# EAGLE design sram (EAGLE 7.3.0)
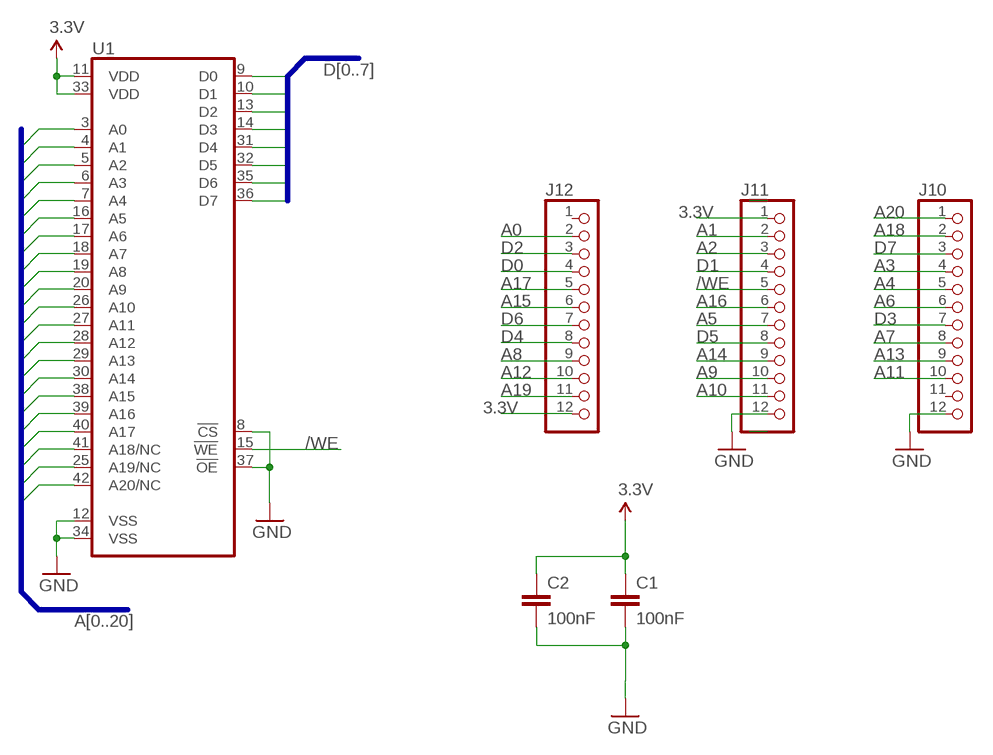
[diagram p0: schematic, sheet 1]

## Parts
C1  100nF  C-EUC0805K  [C0805K]
C2  100nF  C-EUC0805K  [C0805K]
J10  PINHD-1X12  [1X12]
J11  PINHD-1X12  [1X12]
J12  PINHD-1X12  [1X12]
U1  ISSI_SRAM_8BIT  [TSOP44-II]

## Nets
3.3V [power]: C1.1 C2.1 J11.1 J12.12 U1.11(VDD) U1.33(VDD)
/WE: J11.5 U1.15(!WE)
A0: J12.2 U1.3(A0)
A1: J11.2 U1.4(A1)
A2: J11.3 U1.5(A2)
A3: J10.4 U1.6(A3)
A4: J10.5 U1.7(A4)
A5: J11.7 U1.16(A5)
A6: J10.6 U1.17(A6)
A7: J10.8 U1.18(A7)
A8: J12.9 U1.19(A8)
A9: J11.10 U1.20(A9)
A10: J11.11 U1.26(A10)
A11: J10.10 U1.27(A11)
A12: J12.10 U1.28(A12)
A13: J10.9 U1.29(A13)
A14: J11.9 U1.30(A14)
A15: J12.6 U1.38(A15)
A16: J11.6 U1.39(A16)
A17: J12.5 U1.40(A17)
A18: J10.2 U1.41(A18/NC)
A19: J12.11 U1.25(A19/NC)
A20: J10.1 U1.42(A20/NC)
D0: J12.4 U1.9(D0)
D1: J11.4 U1.10(D1)
D2: J12.3 U1.13(D2)
D3: J10.7 U1.14(D3)
D4: J12.8 U1.31(D4)
D5: J11.8 U1.32(D5)
D6: J12.7 U1.35(D6)
D7: J10.3 U1.36(D7)
GND [power]: C1.2 C2.2 J10.12 J11.12 U1.8(!CS) U1.12(VSS) U1.34(VSS) U1.37(!OE)
Unconnected: J10.11 J12.1

## Buses
A[0..20]
D[0..7]

## Library data of the parts
C1 C2 = rcl:C-EU: CAPACITOR, European symbol
J10-J12 = pinhead:PINHD-1X12: PIN HEADER
U1 = GadgetFactory:ISSI_SRAM_8BIT

## Net classes
0 default: width 0.203 mm, clearance 0.203 mm
1 power: width 0.406 mm, clearance 0.203 mm to class 0, clearance 0.203 mm

## Board
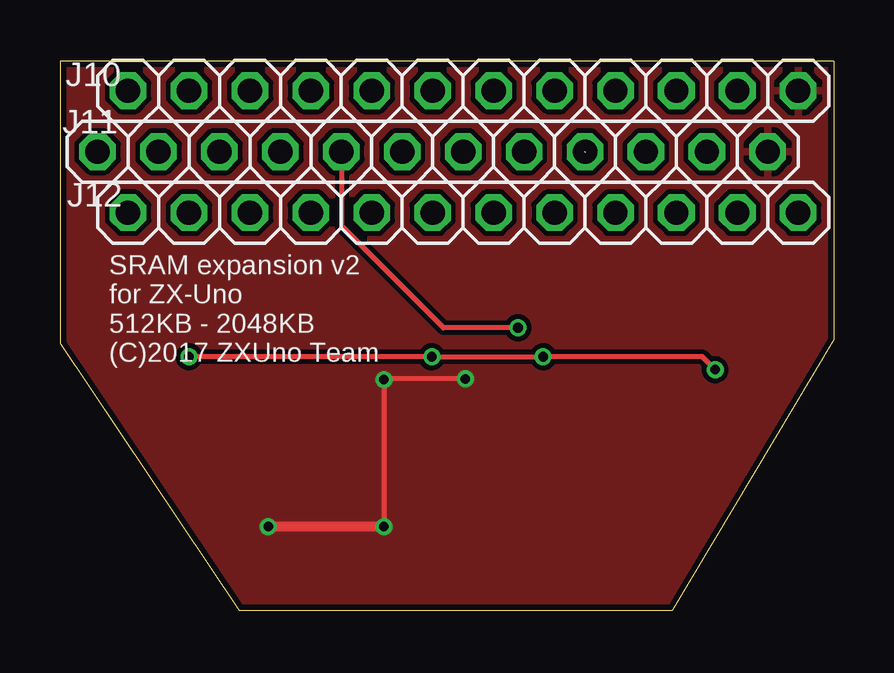
[diagram p1: board, top side]
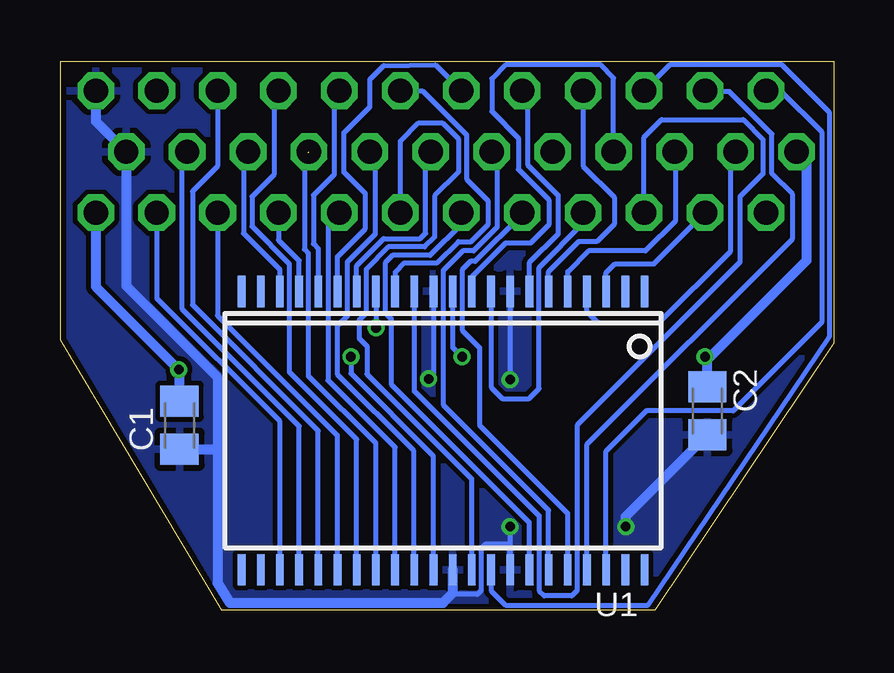
[diagram p2: board, bottom side, seen from below]

Size 32.26 x 22.89 mm. Coordinates in mm from the lower left corner, seen from the top.
Outline: 7.46,0 25.53,0 32.26,11.27 32.26,22.89 0,22.89 0,11.14 7.46,0
Copper layers (1*16): Top 0.035mm / dielectric 1.5mm / Bottom 0.035mm
Design rules "seedstudio_Fusion_eagle_rule_v1.1": minimum track width 6mil, minimum drill 12mil, track to track 6mil, track to pad 6mil, pad to pad 6mil, via to via 6mil, smd to smd 0mil, copper to edge 10mil, drill to drill 10mil, minimum pad ring 10mil, minimum via ring 6mil, stop-mask expansion 2mil, vias tented up to drill 100mil, thermal gap 10mil

### Footprints (pad centres in the part's own frame; a part is rotated, then mirrored left to right if it is on the bottom)
C0805K = smd 1.3 x 1.6: 1 -1,0; 2 1,0
1X12 = drill 1.016 octagon: 1 -13.97,0; 2 -11.43,0; 3 -8.89,0; 4 -6.35,0; 5 -3.81,0; 6 -1.27,0; 7 1.27,0; 8 3.81,0; 9 6.35,0; 10 8.89,0; 11 11.43,0; 12 13.97,0
TSOP44-II = smd 0.32 x 1.3: 1 -8.4,-5.8; 2 -7.6,-5.8; 3 -6.8,-5.8; 4 -6,-5.8; 5 -5.2,-5.8; 6 -4.4,-5.8; 7 -3.6,-5.8; 8 -2.8,-5.8; 9 -2,-5.8; 10 -1.2,-5.8; 11 -0.4,-5.8; 12 0.4,-5.8; 13 1.2,-5.8; 14 2,-5.8; 15 2.8,-5.8; 16 3.6,-5.8; 17 4.4,-5.8; 18 5.2,-5.8; 19 6,-5.8; 20 6.8,-5.8; 21 7.6,-5.8; 22 8.4,-5.8; 23 8.4,5.8; 24 7.6,5.8; 25 6.8,5.8; 26 6,5.8; 27 5.2,5.8; 28 4.4,5.8; 29 3.6,5.8; 30 2.8,5.8; 31 2,5.8; 32 1.2,5.8; 33 0.4,5.8; 34 -0.4,5.8; 35 -1.2,5.8; 36 -2,5.8; 37 -2.8,5.8; 38 -3.6,5.8; 39 -4.4,5.8; 40 -5.2,5.8; 41 -6,5.8; 42 -6.8,5.8; 43 -7.6,5.8; 44 -8.4,5.8

### Placement (x,y rotation side)
C1  27.27,7.72 270 bottom
C2  5.27,8.32 270 bottom
J10  16.8,21.65 0 top
J11  15.53,19.11 0 top
J12  16.8,16.57 0 top
U1  16.29,7.49 180 bottom

### Tracks (layer width: path | path; a pad name or v marks a point on that pad's centre or on a via)
3.3V  (via drill 0.4)
  Top 0.203: v5.37,10.57 v15.49,10.57 v20.13,10.57 26.77,10.57 v27.3,10.03
  Bottom 0.203: U1.11 15.89,10.97 v15.49,10.57 | v20.13,10.57 20.13,9.87 16.69,6.43 U1.33
  Bottom 0.406: J11.1 1.52,19.11 1.14,18.73 1.14,14.57 5.24,10.48 5.27,10.48 | C2.1 5.27,10.48 | 5.27,10.48 v5.37,10.57 | J12.12 30.77,13.49 v27.3,10.03 27.27,10 C1.1
/WE  (via drill 0.4)
  Top 0.203: v19.08,11.78 15.97,11.78 11.75,16 11.75,19.08 J11.5
  Bottom 0.203: U1.15 v19.09,11.79 v19.08,11.78
A0
  Bottom 0.203: U1.3 9.49,14.07 9.11,14.45 7.49,14.45 J12.2
A1
  Bottom 0.203: J11.2 4.13,19.11 4.32,18.92 4.32,14.95 7.3,11.97 9.81,11.97 10.29,12.45 U1.4
A2
  Bottom 0.203: J11.3 6.6,19.14 6.6,16.22 7.84,14.99 10.22,14.99 11.09,14.12 U1.5
A3
  Bottom 0.203: J10.4 10.45,18.51 9.14,17.21 9.14,16.1 9.87,15.37 10.64,15.37 11.89,14.12 U1.6
A4
  Bottom 0.203: J10.5 12.76,21.43 12.76,18.57 11.49,17.3 11.49,15.68 12.7,14.48 12.7,13.3 U1.7
A5
  Bottom 0.203: U1.16 19.89,14.37 18.76,15.49 17.24,15.49 17.02,15.72 17.02,18.89 J11.7
A6
  Bottom 0.203: U1.17 20.69,14.74 19.53,15.91 19.53,17.37 20.41,18.26 20.41,19.91 19.34,20.99 19.34,22.13 18.76,22.7 16.61,22.73 J10.6
A7
  Bottom 0.203: U1.18 21.5,15.08 21.68,15.27 21.68,17.3 20.83,18.16 20.83,21.46 20.64,21.65 J10.8
A8
  Bottom 0.203: J12.9 23.15,15.43 22.29,14.57 U1.19
A9
  Bottom 0.203: J11.10 24.48,19.11 24.61,18.99 24.61,15.72 23.08,14.19 23.09,14.19 U1.20
A10
  Bottom 0.203: U1.26 22.29,7.68 27.18,12.57 27.18,18.89 J11.11
A11
  Bottom 0.203: J10.10 25.69,18.51 26.73,17.46 26.73,12.73 21.49,7.49 U1.27
A12
  Bottom 0.203: J12.10 25.69,12.29 20.69,7.29 U1.28
A13
  Bottom 0.203: U1.29 19.89,7.12 22.7,9.94 22.7,14.45 24.26,16 24.26,17.24 23.34,18.16 23.34,21.5 23.18,21.65 J10.9
A14  (1 unrouted)
  Bottom 0.203: U1.30 19.09,6.96 21.91,9.78 21.91,14.89 22.07,15.05 22.07,18.92 21.91,19.08
A15
  Bottom 0.203: J12.6 15.53,16.1 16.83,14.8 18.38,14.8 18.7,14.48 18.7,12.41 18.45,12.16 18.45,9.43 12.7,3.68 12.7,1.71 U1.38
A16
  Bottom 0.203: J11.6 14.03,18.89 14.03,15.97 15.02,14.99 15.46,14.99 16.29,14.16 16.29,8.57 11.89,4.17 U1.39
A17
  Bottom 0.203: J12.5 12.99,16.51 14.95,14.54 15.14,14.54 15.49,14.19 15.49,11.68 14.76,10.95 14.76,7.71 11.09,4.04 U1.40
A18
  Bottom 0.203: U1.41 10.29,6.92 1.71,15.49 1.71,17.34 2.57,18.19 2.57,19.84 4.35,21.62 5.33,21.62 J10.2
A19
  Bottom 0.203: U1.25 23.09,7.88 28.23,13.02 J12.11
A20
  Bottom 0.203: J10.1 2.22,21.65 0.51,19.94 0.51,12 4.19,8.32 7.81,8.32 9.49,6.64 9.49,6.63 U1.42
D0
  Bottom 0.203: J12.4 10.45,16.13 12.29,14.29 12.29,9.24 12.7,8.83 13.81,8.83 14.29,9.3 U1.9
D1
  Bottom 0.203: J11.4 9.18,22.19 9.72,22.73 13.68,22.73 14.26,22.16 14.26,20.8 13.14,19.68 13.14,18.38 11.87,17.11 11.87,16.07 12.64,15.3 13.68,15.3 15.09,13.9 U1.10
D2
  Bottom 0.203: J12.3 7.91,19.72 7.18,20.45 3.78,20.45 2.95,19.62 2.95,18.19 3.9,17.24 3.9,14.51 10.7,7.71 10.7,0.83 10.92,0.6 12.06,0.6 12.29,0.83 12.29,3.95 17.49,9.15 U1.13
D3
  Bottom 0.203: J10.7 17.14,21.65 15.3,19.81 15.3,17.97 14.41,17.08 14.41,16.07 15.11,15.37 15.65,15.37 16.54,14.48 17.91,14.48 18.29,14.1 U1.14 | U1.14
D4
  Bottom 0.203: J12.8 21.08,16.1 21.08,9.59 18.29,6.79 U1.31
D5
  Bottom 0.203: J11.8 19.34,19.08 19.11,18.86 19.11,15.68 20.29,14.51 20.29,12.26 20.7,11.84 20.7,9.84 17.53,6.67 17.53,1.73 U1.32
D6
  Bottom 0.203: J12.7 18.07,19.56 17.3,20.32 16.32,20.32 15.65,19.65 15.65,18.26 16.64,17.27 16.64,15.56 17.05,15.14 18.57,15.14 19.49,14.22 19.49,12.38 19.78,12.1 19.78,11.34 19.46,11.02 19.46,9.84 15.09,5.47 U1.35
D7
  Bottom 0.203: U1.36 14.29,0.83 13.68,0.22 7.75,0.22 0.19,11.4 0.19,20.77 2.16,22.73 6.83,22.73 J10.3
GND  (via drill 0.4)
  Top 0.203: v13.49,9.62 13.49,9.59 | 13.49,9.59 v13.49,3.49 | v16.89,9.65 13.56,9.65 13.49,9.59
  Top 0.406: v13.49,3.49 v8.67,3.49
  Bottom 0.203: U1.37 13.49,2.25 | 13.49,2.25 13.49,2.57 | 15.89,0.72 15.84,0.67 14.86,0.67 14.7,0.83 14.7,2.57 14.51,2.76 13.53,2.76 13.49,2.73 | U1.8 13.49,11.94 v13.49,9.62 | v13.49,3.49 13.49,2.73 | 13.49,2.73 13.49,2.26 13.49,2.25 | U1.12 16.69,9.86 v16.89,9.65
  Bottom 0.406: J10.12 30.77,20.38 J11.12 29.5,13.53 25.69,9.72 25.69,6.76 | 25.69,6.76 25.69,1.14 25.18,0.32 16.29,0.32 15.89,0.72 U1.34 | C1.2 25.73,6.71 25.69,6.76 | v8.67,3.49 8.67,3.92 C2.2
  pour Bottom: 0.16,22.73 32.1,22.73 32.04,0.19 0.16,0.19
  pour Top: 0.16,22.73 32.1,22.73 32.04,0.19 0.16,0.19

### Text on the board
tNames: SRAM expansion v2 / for ZX-Uno / 512KB - 2048KB / (C)2017 ZXUno Team